# EAGLE schematic input-selector (EAGLE 6.6.0)
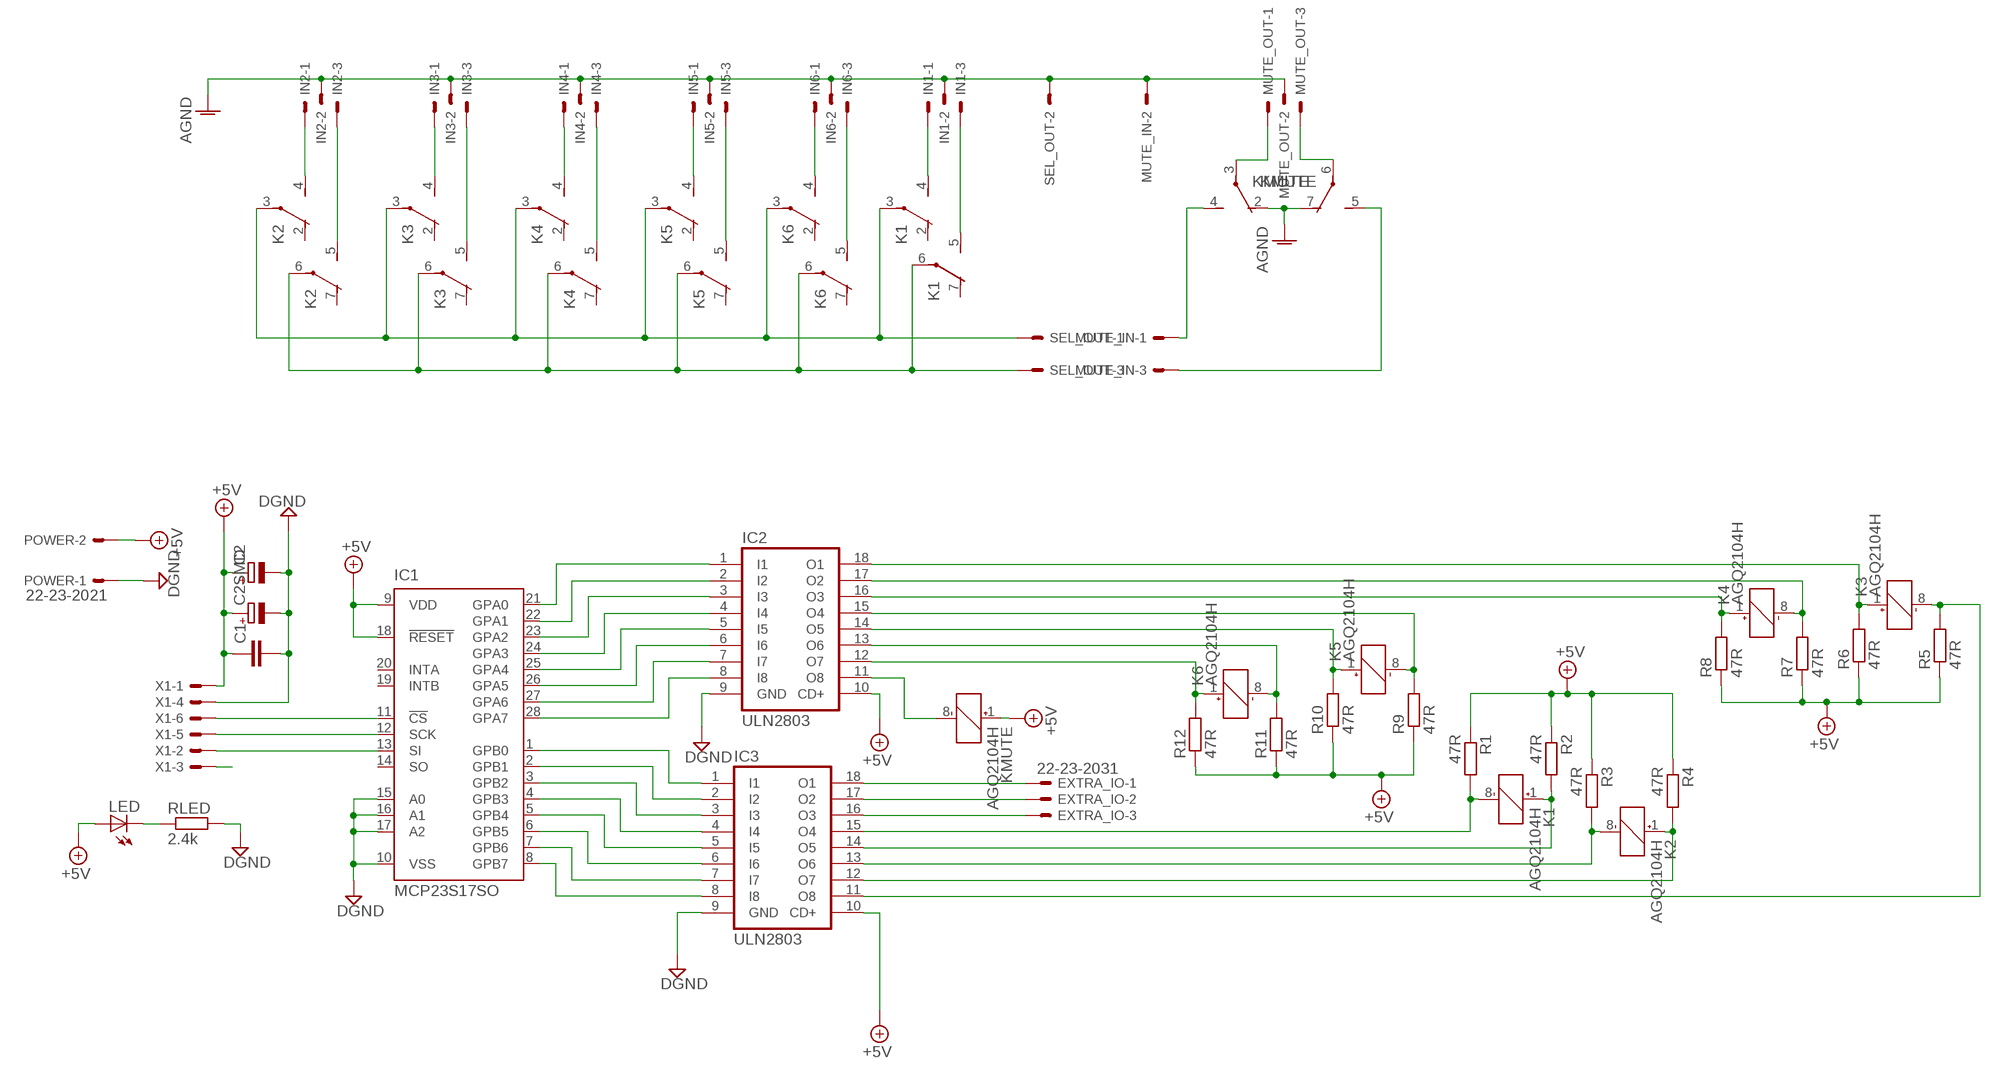
[diagram p0: schematic, sheet 1]

## Parts
C1  C-EUC1206  [C1206]
C2  CPOL-EUE3.5-8  [E3,5-8]
C2SMD  CPOL-EUE  [PANASONIC_E]
EXTRA_IO  22-23-2031  [22-23-2031]
IC1  MCP23S17SO  [SO28W]
IC2  ULN2803  ULN2803ADW  [SO-18W]
IC3  ULN2803  ULN2803ADW  [SO-18W]
IN1  22-23-2031  [22-23-2031]
IN2  22-23-2031  [22-23-2031]
IN3  22-23-2031  [22-23-2031]
IN4  22-23-2031  [22-23-2031]
IN5  22-23-2031  [22-23-2031]
IN6  22-23-2031  [22-23-2031]
K1  AGQ2104H  [PCBBOARD]
K2  AGQ2104H  [PCBBOARD]
K3  AGQ2104H  [PCBBOARD]
K4  AGQ2104H  [PCBBOARD]
K5  AGQ2104H  [PCBBOARD]
K6  AGQ2104H  [PCBBOARD]
KMUTE  AGQ2104H  [PCBBOARD]
LED  LEDSMT1206  [1206]
MUTE_IN  22-23-2031  [22-23-2031]
MUTE_OUT  22-23-2031  [22-23-2031]
POWER  22-23-2021  [22-23-2021]
R1  47R  R-EU_R1206  [R1206]
R2  47R  R-EU_R1206  [R1206]
R3  47R  R-EU_R1206  [R1206]
R4  47R  R-EU_R1206  [R1206]
R5  47R  R-EU_R1206  [R1206]
R6  47R  R-EU_R1206  [R1206]
R7  47R  R-EU_R1206  [R1206]
R8  47R  R-EU_R1206  [R1206]
R9  47R  R-EU_R1206  [R1206]
R10  47R  R-EU_R1206  [R1206]
R11  47R  R-EU_R1206  [R1206]
R12  47R  R-EU_R1206  [R1206]
RLED  2.4k  R-EU_R1206  [R1206]
SEL_OUT  22-23-2031  [22-23-2031]
X1  22-23-2061  [22-23-2061]

## Nets
+5V: C1.1 C2.+ C2SMD.+ IC1.9(VDD) IC1.18(!RESET) IC2.10(CD+) IC3.10(CD+) KMUTE.1(+) LED.A POWER.2 R1.1 R2.1 R3.1 R4.1 R5.1 R6.1 R7.1 R8.1 R9.1 R10.1 R11.1 R12.1 X1.1
AGND: IN1.2 IN2.2 IN3.2 IN4.2 IN5.2 IN6.2 KMUTE.2(O) KMUTE.7(O) MUTE_IN.2 MUTE_OUT.2 SEL_OUT.2
CLK: IC1.12(SCK) X1.5
CS: IC1.11(!CS) X1.6
DGND: C1.2 C2.- C2SMD.- IC1.10(VSS) IC1.15(A0) IC1.16(A1) IC1.17(A2) IC2.9(GND) IC3.9(GND) POWER.1 RLED.2 X1.4
INL: K1.3(P) K2.3(P) K3.3(P) K4.3(P) K5.3(P) K6.3(P) SEL_OUT.1
INR: K1.6(P) K2.6(P) K3.6(P) K4.6(P) K5.6(P) K6.6(P) SEL_OUT.3
N$1: IN1.1 K1.4(S)
N$2: EXTRA_IO.2 IC3.17(O2)
N$3: IN1.3 K1.5(S)
N$4: EXTRA_IO.3 IC3.16(O3)
N$5: IC3.15(O4) K1.8(-) R1.2
N$6: IC2.11(O8) KMUTE.8(-)
N$7: IC1.21(GPA0) IC2.1(I1)
N$8: IC3.14(O5) K1.1(+) R2.2
N$9: IC3.13(O6) K2.8(-) R3.2
N$10: EXTRA_IO.1 IC3.18(O1)
N$11: IC2.16(O3) K4.1(+) R8.2
N$12: IC3.12(O7) K2.1(+) R4.2
N$13: IC3.11(O8) K3.8(-) R5.2
N$14: IC2.18(O1) K3.1(+) R6.2
N$15: IC2.15(O4) K5.8(-) R9.2
N$16: IC2.13(O6) K6.8(-) R11.2
N$17: KMUTE.6(P) MUTE_OUT.3
N$18: KMUTE.3(P) MUTE_OUT.1
N$19: IC2.12(O7) K6.1(+) R12.2
N$21: IC1.23(GPA2) IC2.3(I3)
N$22: IC2.17(O2) K4.8(-) R7.2
N$23: IC2.14(O5) K5.1(+) R10.2
N$26: IN5.1 K5.4(S)
N$27: IN5.3 K5.5(S)
N$28: IN6.1 K6.4(S)
N$29: IN6.3 K6.5(S)
N$31: IN2.1 K2.4(S)
N$32: IN2.3 K2.5(S)
N$33: IN3.1 K3.4(S)
N$34: IN3.3 K3.5(S)
N$35: IN4.1 K4.4(S)
N$36: IN4.3 K4.5(S)
N$37: IC1.25(GPA4) IC2.5(I5)
N$39: IC1.27(GPA6) IC2.7(I7)
N$41: IC1.1(GPB0) IC3.1(I1)
N$42: IC1.2(GPB1) IC3.2(I2)
N$43: IC1.3(GPB2) IC3.3(I3)
N$44: IC1.4(GPB3) IC3.4(I4)
N$45: IC1.5(GPB4) IC3.5(I5)
N$46: IC1.6(GPB5) IC3.6(I6)
N$47: IC1.7(GPB6) IC3.7(I7)
N$48: IC1.8(GPB7) IC3.8(I8)
N$51: IC1.22(GPA1) IC2.2(I2)
N$53: IC1.24(GPA3) IC2.4(I4)
N$55: IC1.26(GPA5) IC2.6(I6)
N$57: IC1.28(GPA7) IC2.8(I8)
N$67: LED.C RLED.1
NC: X1.3
OUTL: KMUTE.4(S) MUTE_IN.1
OUTR: KMUTE.5(S) MUTE_IN.3
SDI: IC1.13(SI) X1.2
Unconnected: IC1.14(SO) IC1.19(INTB) IC1.20(INTA) K1.2(O) K1.7(O) K2.2(O) K2.7(O) K3.2(O) K3.7(O) K4.2(O) K4.7(O) K5.2(O) K5.7(O) K6.2(O) K6.7(O)

## Library data of the parts
C1 = rcl:C-EU: CAPACITOR, European symbol
C2 C2SMD = rcl:CPOL-EU: POLARIZED CAPACITOR, European symbol
EXTRA_IO IN1-IN6 MUTE_IN MUTE_OUT SEL_OUT = con-molex:22-23-2031: .100" (2.54mm) Center Header - 3 Pin; MF: MOLEX; MPN: 22-23-2031; OC_FARNELL: 1462950; OC_NEWARK: 30C0862
IC1 = microchip:MCP23S17: http://ww1.microchip.com/downloads/en/DeviceDoc/21952a.pdf Source: http://ww1.microchip.com/downloads/en/DeviceDoc/21952a.pdf; MF: MICROCHIP; MPN: MCP23S17-E/SO; OC_FARNELL: unknown; OC_NEWARK: 31K2950
IC2 IC3 = uln-udn-mine:ULN2803ADW
K1-K6 KMUTE = panasonic-agq:AGQ2104H: Panasonic AGQ RELAYS High sensitivity single side stable type (Nominal operating power: 100mW) is available Outstanding surge resistance The use of twin crossbar contacts ensures high contact reliability Datasheet URL: http://www3.panasonic.biz/ac/e_download/control/relay/signal/catalog/mech_eng_gq.pdf
LED = led:LED: LED OSRAM: - CHIPLED LG R971, LG N971, LY N971, LG Q971, LY Q971, LO R971, LY R971 LH N974, LH R974 LS Q976, LO Q976, LY Q976 LO Q996 - Hyper CHIPLED LW Q18S LB Q993, LB Q99A, LB R99A - SideLED LS A670, LO A670, LY A670, LG A670, LP A670 LB A673, LV A673, LT A673, LW A673 LH A674 LY A675 LS A676, LA A676, LO A676, LY A676, LW A676 LS A679, LY A679, LG A679 - Hyper Micro SIDELED® LS Y876, LA Y876, LO Y876, LY Y876 LT Y87S - SmartLED LW L88C, LW L88S LB L89C, LB L89S, LG L890 LS L89K, LO L89K, LY L89K LS L896, LA L896, LO L896, LY L896 - TOPLED LS T670, LO T670, LY T670, LG T670, LP T670 LSG T670, LSP T670, LSY T670, LOP T670, LYG T670 LG T671, LOG T671, LSG T671 LB T673, LV T673, LT T673, LW T673 LH T674 LS T676, LA T676, LO T676, LY T676, LB T676, LH T676, LSB T676, LW T676 LB T67C, LV T67C, LT T67C, LS T67K, LO T67K, LY T67K, LW E67C LS E67B, LA E67B, LO E67B, LY E67B, LB E67C, LV E67C, LT E67C LW T67C LS T679, LY T679, LG T679 LS T770, LO T770, LY T770, LG T770, LP T770 LB T773, LV T773, LT T773, LW T773 LH T774 LS E675, LA E675, LY E675, LS T675 LS T776, LA T776, LO T776, LY T776, LB T776 LHGB T686 LT T68C, LB T68C - Hyper Mini TOPLED® LB M676 - Mini TOPLED Santana® LG M470 LS M47K, LO M47K, LY M47K Source: http://www.osram.convergy.de LUXEON: - LUMILED® LXK2-PW12-R00, LXK2-PW12-S00, LXK2-PW14-U00, LXK2-PW14-V00 LXK2-PM12-R00, LXK2-PM12-S00, LXK2-PM14-U00 LXK2-PE12-Q00, LXK2-PE12-R00, LXK2-PE12-S00, LXK2-PE14-T00, LXK2-PE14-U00 LXK2-PB12-K00, LXK2-PB12-L00, LXK2-PB12-M00, LXK2-PB14-N00, LXK2-PB14-P00, LXK2-PB14-Q00 LXK2-PR12-L00, LXK2-PR12-M00, LXK2-PR14-Q00, LXK2-PR14-R00 LXK2-PD12-Q00, LXK2-PD12-R00, LXK2-PD12-S00 LXK2-PH12-R00, LXK2-PH12-S00 LXK2-PL12-P00, LXK2-PL12-Q00, LXK2-PL12-R00 Source: www.luxeon.com KINGBRIGHT: KA-3528ASYC Source: www.kingbright.com
POWER = con-molex:22-23-2021: .100" (2.54mm) Center Header - 2 Pin; MF: MOLEX; MPN: 22-23-2021; OC_FARNELL: 1462926; OC_NEWARK: 25C3832
R1-R12 RLED = rcl:R-EU_: RESISTOR, European symbol
X1 = con-molex:22-23-2061: .100" (2.54mm) Center Header - 6 Pin; MF: MOLEX; MPN: 22-23-2061; OC_FARNELL: 1462922; OC_NEWARK: 27C1933